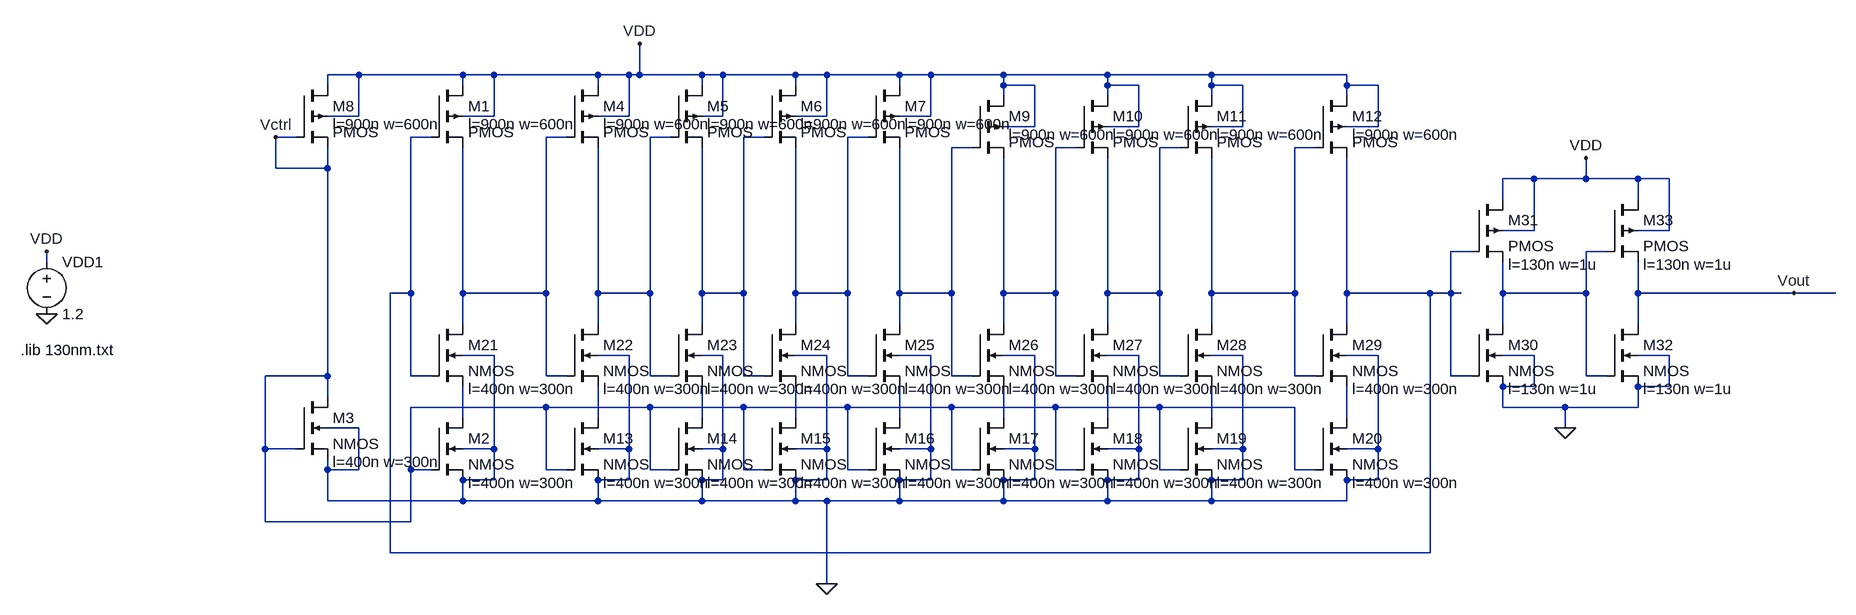
[diagram p0: schematic VCO_VCO.asc]
VCO_VCO.asc, the LTspice schematic file:
Version 4
SHEET 1 2424 680
WIRE -992 -1680 -1040 -1680
WIRE -832 -1680 -992 -1680
WIRE -784 -1680 -832 -1680
WIRE -624 -1680 -784 -1680
WIRE -576 -1680 -624 -1680
WIRE -560 -1680 -560 -1728
WIRE -560 -1680 -576 -1680
WIRE -464 -1680 -560 -1680
WIRE -432 -1680 -464 -1680
WIRE -320 -1680 -432 -1680
WIRE -272 -1680 -320 -1680
WIRE -160 -1680 -272 -1680
WIRE -112 -1680 -160 -1680
WIRE 0 -1680 -112 -1680
WIRE 160 -1680 0 -1680
WIRE 320 -1680 160 -1680
WIRE 528 -1680 320 -1680
WIRE -1040 -1664 -1040 -1680
WIRE -832 -1664 -832 -1680
WIRE -624 -1664 -624 -1680
WIRE -464 -1664 -464 -1680
WIRE -320 -1664 -320 -1680
WIRE -160 -1664 -160 -1680
WIRE 0 -1664 0 -1680
WIRE 48 -1664 0 -1664
WIRE 160 -1664 160 -1680
WIRE 208 -1664 160 -1664
WIRE 320 -1664 320 -1680
WIRE 368 -1664 320 -1664
WIRE 528 -1664 528 -1680
WIRE 576 -1664 528 -1664
WIRE 0 -1648 0 -1664
WIRE 160 -1648 160 -1664
WIRE 320 -1648 320 -1664
WIRE 528 -1648 528 -1664
WIRE -992 -1616 -992 -1680
WIRE -992 -1616 -1040 -1616
WIRE -784 -1616 -784 -1680
WIRE -784 -1616 -832 -1616
WIRE -576 -1616 -576 -1680
WIRE -576 -1616 -624 -1616
WIRE -432 -1616 -432 -1680
WIRE -432 -1616 -464 -1616
WIRE -272 -1616 -272 -1680
WIRE -272 -1616 -320 -1616
WIRE -112 -1616 -112 -1680
WIRE -112 -1616 -160 -1616
WIRE 48 -1600 48 -1664
WIRE 48 -1600 0 -1600
WIRE 208 -1600 208 -1664
WIRE 208 -1600 160 -1600
WIRE 368 -1600 368 -1664
WIRE 368 -1600 320 -1600
WIRE 576 -1600 576 -1664
WIRE 576 -1600 528 -1600
WIRE -1088 -1584 -1120 -1584
WIRE -880 -1584 -912 -1584
WIRE -672 -1584 -704 -1584
WIRE -512 -1584 -544 -1584
WIRE -368 -1584 -400 -1584
WIRE -208 -1584 -240 -1584
WIRE -48 -1568 -80 -1568
WIRE 112 -1568 80 -1568
WIRE 272 -1568 240 -1568
WIRE 480 -1568 448 -1568
WIRE -1120 -1536 -1120 -1584
WIRE -1040 -1536 -1040 -1568
WIRE -1040 -1536 -1120 -1536
WIRE 816 -1520 768 -1520
WIRE 896 -1520 896 -1552
WIRE 896 -1520 816 -1520
WIRE 976 -1520 896 -1520
WIRE 1024 -1520 976 -1520
WIRE 768 -1488 768 -1520
WIRE 976 -1488 976 -1520
WIRE 816 -1440 816 -1520
WIRE 816 -1440 768 -1440
WIRE 1024 -1440 1024 -1520
WIRE 1024 -1440 976 -1440
WIRE 720 -1408 688 -1408
WIRE 928 -1408 896 -1408
WIRE -1472 -1392 -1472 -1408
WIRE -912 -1344 -912 -1584
WIRE -912 -1344 -944 -1344
WIRE -832 -1344 -832 -1568
WIRE -704 -1344 -704 -1584
WIRE -704 -1344 -832 -1344
WIRE -624 -1344 -624 -1568
WIRE -544 -1344 -544 -1584
WIRE -544 -1344 -624 -1344
WIRE -464 -1344 -464 -1568
WIRE -400 -1344 -400 -1584
WIRE -400 -1344 -464 -1344
WIRE -320 -1344 -320 -1568
WIRE -240 -1344 -240 -1584
WIRE -240 -1344 -320 -1344
WIRE -160 -1344 -160 -1568
WIRE -80 -1344 -80 -1568
WIRE -80 -1344 -160 -1344
WIRE 0 -1344 0 -1552
WIRE 80 -1344 80 -1568
WIRE 80 -1344 0 -1344
WIRE 160 -1344 160 -1552
WIRE 240 -1344 240 -1568
WIRE 240 -1344 160 -1344
WIRE 320 -1344 320 -1552
WIRE 448 -1344 448 -1568
WIRE 448 -1344 320 -1344
WIRE 528 -1344 528 -1552
WIRE 656 -1344 528 -1344
WIRE 688 -1344 688 -1408
WIRE 688 -1344 656 -1344
WIRE 704 -1344 688 -1344
WIRE 768 -1344 768 -1392
WIRE 896 -1344 896 -1408
WIRE 896 -1344 768 -1344
WIRE 976 -1344 976 -1392
WIRE 1216 -1344 976 -1344
WIRE 1280 -1344 1216 -1344
WIRE -832 -1296 -832 -1344
WIRE -624 -1296 -624 -1344
WIRE -464 -1296 -464 -1344
WIRE -320 -1296 -320 -1344
WIRE -160 -1296 -160 -1344
WIRE 0 -1296 0 -1344
WIRE 160 -1296 160 -1344
WIRE 320 -1296 320 -1344
WIRE 528 -1296 528 -1344
WIRE 768 -1296 768 -1344
WIRE 976 -1296 976 -1344
WIRE -784 -1248 -832 -1248
WIRE -576 -1248 -624 -1248
WIRE -432 -1248 -464 -1248
WIRE -272 -1248 -320 -1248
WIRE -112 -1248 -160 -1248
WIRE 48 -1248 0 -1248
WIRE 208 -1248 160 -1248
WIRE 368 -1248 320 -1248
WIRE 576 -1248 528 -1248
WIRE 816 -1248 768 -1248
WIRE 1024 -1248 976 -1248
WIRE -1040 -1216 -1040 -1536
WIRE -1040 -1216 -1136 -1216
WIRE -912 -1216 -912 -1344
WIRE -880 -1216 -912 -1216
WIRE -704 -1216 -704 -1344
WIRE -672 -1216 -704 -1216
WIRE -544 -1216 -544 -1344
WIRE -512 -1216 -544 -1216
WIRE -400 -1216 -400 -1344
WIRE -368 -1216 -400 -1216
WIRE -240 -1216 -240 -1344
WIRE -208 -1216 -240 -1216
WIRE -80 -1216 -80 -1344
WIRE -48 -1216 -80 -1216
WIRE 80 -1216 80 -1344
WIRE 112 -1216 80 -1216
WIRE 240 -1216 240 -1344
WIRE 272 -1216 240 -1216
WIRE 448 -1216 448 -1344
WIRE 480 -1216 448 -1216
WIRE 688 -1216 688 -1344
WIRE 720 -1216 688 -1216
WIRE 896 -1216 896 -1344
WIRE 928 -1216 896 -1216
WIRE 816 -1200 816 -1248
WIRE 816 -1200 768 -1200
WIRE 1024 -1200 1024 -1248
WIRE 1024 -1200 976 -1200
WIRE -1040 -1184 -1040 -1216
WIRE -704 -1168 -912 -1168
WIRE -544 -1168 -704 -1168
WIRE -400 -1168 -544 -1168
WIRE -240 -1168 -400 -1168
WIRE -80 -1168 -240 -1168
WIRE 80 -1168 -80 -1168
WIRE 240 -1168 80 -1168
WIRE 448 -1168 240 -1168
WIRE 768 -1168 768 -1200
WIRE 864 -1168 768 -1168
WIRE 976 -1168 976 -1200
WIRE 976 -1168 864 -1168
WIRE -832 -1152 -832 -1200
WIRE -624 -1152 -624 -1200
WIRE -464 -1152 -464 -1200
WIRE -320 -1152 -320 -1200
WIRE -160 -1152 -160 -1200
WIRE 0 -1152 0 -1200
WIRE 160 -1152 160 -1200
WIRE 320 -1152 320 -1200
WIRE 528 -1152 528 -1200
WIRE -992 -1136 -1040 -1136
WIRE 864 -1136 864 -1168
WIRE -1136 -1104 -1136 -1216
WIRE -1088 -1104 -1136 -1104
WIRE -784 -1104 -784 -1248
WIRE -784 -1104 -832 -1104
WIRE -576 -1104 -576 -1248
WIRE -576 -1104 -624 -1104
WIRE -432 -1104 -432 -1248
WIRE -432 -1104 -464 -1104
WIRE -272 -1104 -272 -1248
WIRE -272 -1104 -320 -1104
WIRE -112 -1104 -112 -1248
WIRE -112 -1104 -160 -1104
WIRE 48 -1104 48 -1248
WIRE 48 -1104 0 -1104
WIRE 208 -1104 208 -1248
WIRE 208 -1104 160 -1104
WIRE 368 -1104 368 -1248
WIRE 368 -1104 320 -1104
WIRE 576 -1104 576 -1248
WIRE 576 -1104 528 -1104
WIRE -1040 -1072 -1040 -1088
WIRE -992 -1072 -992 -1136
WIRE -992 -1072 -1040 -1072
WIRE -912 -1072 -912 -1168
WIRE -880 -1072 -912 -1072
WIRE -704 -1072 -704 -1168
WIRE -672 -1072 -704 -1072
WIRE -544 -1072 -544 -1168
WIRE -512 -1072 -544 -1072
WIRE -400 -1072 -400 -1168
WIRE -368 -1072 -400 -1072
WIRE -240 -1072 -240 -1168
WIRE -208 -1072 -240 -1072
WIRE -80 -1072 -80 -1168
WIRE -48 -1072 -80 -1072
WIRE 80 -1072 80 -1168
WIRE 112 -1072 80 -1072
WIRE 240 -1072 240 -1168
WIRE 272 -1072 240 -1072
WIRE 448 -1072 448 -1168
WIRE 480 -1072 448 -1072
WIRE -784 -1056 -784 -1104
WIRE -784 -1056 -832 -1056
WIRE -576 -1056 -576 -1104
WIRE -576 -1056 -624 -1056
WIRE -432 -1056 -432 -1104
WIRE -432 -1056 -464 -1056
WIRE -272 -1056 -272 -1104
WIRE -272 -1056 -320 -1056
WIRE -112 -1056 -112 -1104
WIRE -112 -1056 -160 -1056
WIRE 48 -1056 48 -1104
WIRE 48 -1056 0 -1056
WIRE 208 -1056 208 -1104
WIRE 208 -1056 160 -1056
WIRE 368 -1056 368 -1104
WIRE 368 -1056 320 -1056
WIRE 576 -1056 576 -1104
WIRE 576 -1056 528 -1056
WIRE -1040 -1024 -1040 -1072
WIRE -832 -1024 -832 -1056
WIRE -832 -1024 -1040 -1024
WIRE -624 -1024 -624 -1056
WIRE -624 -1024 -832 -1024
WIRE -464 -1024 -464 -1056
WIRE -464 -1024 -624 -1024
WIRE -320 -1024 -320 -1056
WIRE -320 -1024 -464 -1024
WIRE -272 -1024 -320 -1024
WIRE -160 -1024 -160 -1056
WIRE -160 -1024 -272 -1024
WIRE 0 -1024 0 -1056
WIRE 0 -1024 -160 -1024
WIRE 160 -1024 160 -1056
WIRE 160 -1024 0 -1024
WIRE 320 -1024 320 -1056
WIRE 320 -1024 160 -1024
WIRE 528 -1024 528 -1056
WIRE 528 -1024 320 -1024
WIRE -1136 -992 -1136 -1104
WIRE -912 -992 -912 -1072
WIRE -912 -992 -1136 -992
WIRE -944 -944 -944 -1344
WIRE 656 -944 656 -1344
WIRE 656 -944 -944 -944
WIRE -272 -896 -272 -1024
FLAG -1472 -1312 0
FLAG -1472 -1408 VDD
FLAG -560 -1728 VDD
FLAG -1120 -1584 Vctrl
FLAG -272 -896 0
FLAG 864 -1136 0
FLAG 896 -1552 VDD
FLAG 1216 -1344 Vout
SYMBOL voltage -1472 -1408 R0
WINDOW 123 0 0 Left 0
WINDOW 39 24 124 Left 2
SYMATTR InstName VDD1
SYMATTR Value 1.2
SYMBOL pmos4 -880 -1664 R0
WINDOW 123 56 60 Left 2
SYMATTR Value2 l=900n w=600n
SYMATTR InstName M1
SYMBOL nmos4 -880 -1152 R0
WINDOW 123 56 100 Left 2
SYMATTR Value2 l=400n w=300n
SYMATTR InstName M2
SYMBOL nmos4 -1088 -1184 R0
WINDOW 123 56 100 Left 2
SYMATTR Value2 l=400n w=300n
SYMATTR InstName M3
SYMBOL pmos4 -672 -1664 R0
WINDOW 123 56 60 Left 2
SYMATTR Value2 l=900n w=600n
SYMATTR InstName M4
SYMBOL pmos4 -512 -1664 R0
WINDOW 123 56 60 Left 2
SYMATTR Value2 l=900n w=600n
SYMATTR InstName M5
SYMBOL pmos4 -368 -1664 R0
WINDOW 123 56 60 Left 2
SYMATTR Value2 l=900n w=600n
SYMATTR InstName M6
SYMBOL pmos4 -208 -1664 R0
WINDOW 123 56 60 Left 2
SYMATTR Value2 l=900n w=600n
SYMATTR InstName M7
SYMBOL pmos4 -1088 -1664 R0
WINDOW 123 56 60 Left 2
SYMATTR Value2 l=900n w=600n
SYMATTR InstName M8
SYMBOL pmos4 -48 -1648 R0
WINDOW 123 56 60 Left 2
SYMATTR Value2 l=900n w=600n
SYMATTR InstName M9
SYMBOL pmos4 112 -1648 R0
WINDOW 123 56 60 Left 2
SYMATTR Value2 l=900n w=600n
SYMATTR InstName M10
SYMBOL pmos4 272 -1648 R0
WINDOW 123 56 60 Left 2
SYMATTR Value2 l=900n w=600n
SYMATTR InstName M11
SYMBOL pmos4 480 -1648 R0
WINDOW 123 56 60 Left 2
SYMATTR Value2 l=900n w=600n
SYMATTR InstName M12
SYMBOL nmos4 -672 -1152 R0
WINDOW 123 56 100 Left 2
SYMATTR Value2 l=400n w=300n
SYMATTR InstName M13
SYMBOL nmos4 -512 -1152 R0
WINDOW 123 56 100 Left 2
SYMATTR Value2 l=400n w=300n
SYMATTR InstName M14
SYMBOL nmos4 -368 -1152 R0
WINDOW 123 56 100 Left 2
SYMATTR Value2 l=400n w=300n
SYMATTR InstName M15
SYMBOL nmos4 -208 -1152 R0
WINDOW 123 56 100 Left 2
SYMATTR Value2 l=400n w=300n
SYMATTR InstName M16
SYMBOL nmos4 -48 -1152 R0
WINDOW 123 56 100 Left 2
SYMATTR Value2 l=400n w=300n
SYMATTR InstName M17
SYMBOL nmos4 112 -1152 R0
WINDOW 123 56 100 Left 2
SYMATTR Value2 l=400n w=300n
SYMATTR InstName M18
SYMBOL nmos4 272 -1152 R0
WINDOW 123 56 100 Left 2
SYMATTR Value2 l=400n w=300n
SYMATTR InstName M19
SYMBOL nmos4 480 -1152 R0
WINDOW 123 56 100 Left 2
SYMATTR Value2 l=400n w=300n
SYMATTR InstName M20
SYMBOL nmos4 -880 -1296 R0
WINDOW 123 56 100 Left 2
SYMATTR Value2 l=400n w=300n
SYMATTR InstName M21
SYMBOL nmos4 -672 -1296 R0
WINDOW 123 56 100 Left 2
SYMATTR Value2 l=400n w=300n
SYMATTR InstName M22
SYMBOL nmos4 -512 -1296 R0
WINDOW 123 56 100 Left 2
SYMATTR Value2 l=400n w=300n
SYMATTR InstName M23
SYMBOL nmos4 -368 -1296 R0
WINDOW 123 56 100 Left 2
SYMATTR Value2 l=400n w=300n
SYMATTR InstName M24
SYMBOL nmos4 -208 -1296 R0
WINDOW 123 56 100 Left 2
SYMATTR Value2 l=400n w=300n
SYMATTR InstName M25
SYMBOL nmos4 -48 -1296 R0
WINDOW 123 56 100 Left 2
SYMATTR Value2 l=400n w=300n
SYMATTR InstName M26
SYMBOL nmos4 112 -1296 R0
WINDOW 123 56 100 Left 2
SYMATTR Value2 l=400n w=300n
SYMATTR InstName M27
SYMBOL nmos4 272 -1296 R0
WINDOW 123 56 100 Left 2
SYMATTR Value2 l=400n w=300n
SYMATTR InstName M28
SYMBOL nmos4 480 -1296 R0
WINDOW 123 56 100 Left 2
SYMATTR Value2 l=400n w=300n
SYMATTR InstName M29
SYMBOL nmos4 720 -1296 R0
WINDOW 123 56 100 Left 2
SYMATTR Value2 l=130n w=1u
SYMATTR InstName M30
SYMBOL pmos4 720 -1488 R0
WINDOW 123 56 100 Left 2
SYMATTR Value2 l=130n w=1u
SYMATTR InstName M31
SYMBOL nmos4 928 -1296 R0
WINDOW 123 56 100 Left 2
SYMATTR Value2 l=130n w=1u
SYMATTR InstName M32
SYMBOL pmos4 928 -1488 R0
WINDOW 123 56 100 Left 2
SYMATTR Value2 l=130n w=1u
SYMATTR InstName M33
TEXT -1512 -1256 Left 2 !.lib 130nm.txt

The netlist it stands for:
* VCO_VCO.asc
VDD1 VDD 0 1.2
M1 VDD N001 N002 VDD PMOS l=900n w=600n
M2 N011 Vctrl 0 0 NMOS l=400n w=300n
M3 Vctrl Vctrl 0 0 NMOS l=400n w=300n
M4 VDD N002 N003 VDD PMOS l=900n w=600n
M5 VDD N003 N004 VDD PMOS l=900n w=600n
M6 VDD N004 N005 VDD PMOS l=900n w=600n
M7 VDD N005 N006 VDD PMOS l=900n w=600n
M8 VDD Vctrl Vctrl VDD PMOS l=900n w=600n
M9 VDD N006 N007 VDD PMOS l=900n w=600n
M10 VDD N007 N008 VDD PMOS l=900n w=600n
M11 VDD N008 N009 VDD PMOS l=900n w=600n
M12 VDD N009 N001 VDD PMOS l=900n w=600n
M13 N012 Vctrl 0 0 NMOS l=400n w=300n
M14 N013 Vctrl 0 0 NMOS l=400n w=300n
M15 N014 Vctrl 0 0 NMOS l=400n w=300n
M16 N015 Vctrl 0 0 NMOS l=400n w=300n
M17 N016 Vctrl 0 0 NMOS l=400n w=300n
M18 N017 Vctrl 0 0 NMOS l=400n w=300n
M19 N018 Vctrl 0 0 NMOS l=400n w=300n
M20 N019 Vctrl 0 0 NMOS l=400n w=300n
M21 N002 N001 N011 0 NMOS l=400n w=300n
M22 N003 N002 N012 0 NMOS l=400n w=300n
M23 N004 N003 N013 0 NMOS l=400n w=300n
M24 N005 N004 N014 0 NMOS l=400n w=300n
M25 N006 N005 N015 0 NMOS l=400n w=300n
M26 N007 N006 N016 0 NMOS l=400n w=300n
M27 N008 N007 N017 0 NMOS l=400n w=300n
M28 N009 N008 N018 0 NMOS l=400n w=300n
M29 N001 N009 N019 0 NMOS l=400n w=300n
M30 N010 N001 0 0 NMOS l=130n w=1u
M31 VDD N001 N010 VDD PMOS l=130n w=1u
M32 Vout N010 0 0 NMOS l=130n w=1u
M33 VDD N010 Vout VDD PMOS l=130n w=1u
.model NMOS NMOS
.model PMOS PMOS
.lib standard.mos
.lib 130nm.txt
.backanno
.end